# EasyEDA Pro project GD32_V1.1.epro, board PCB1
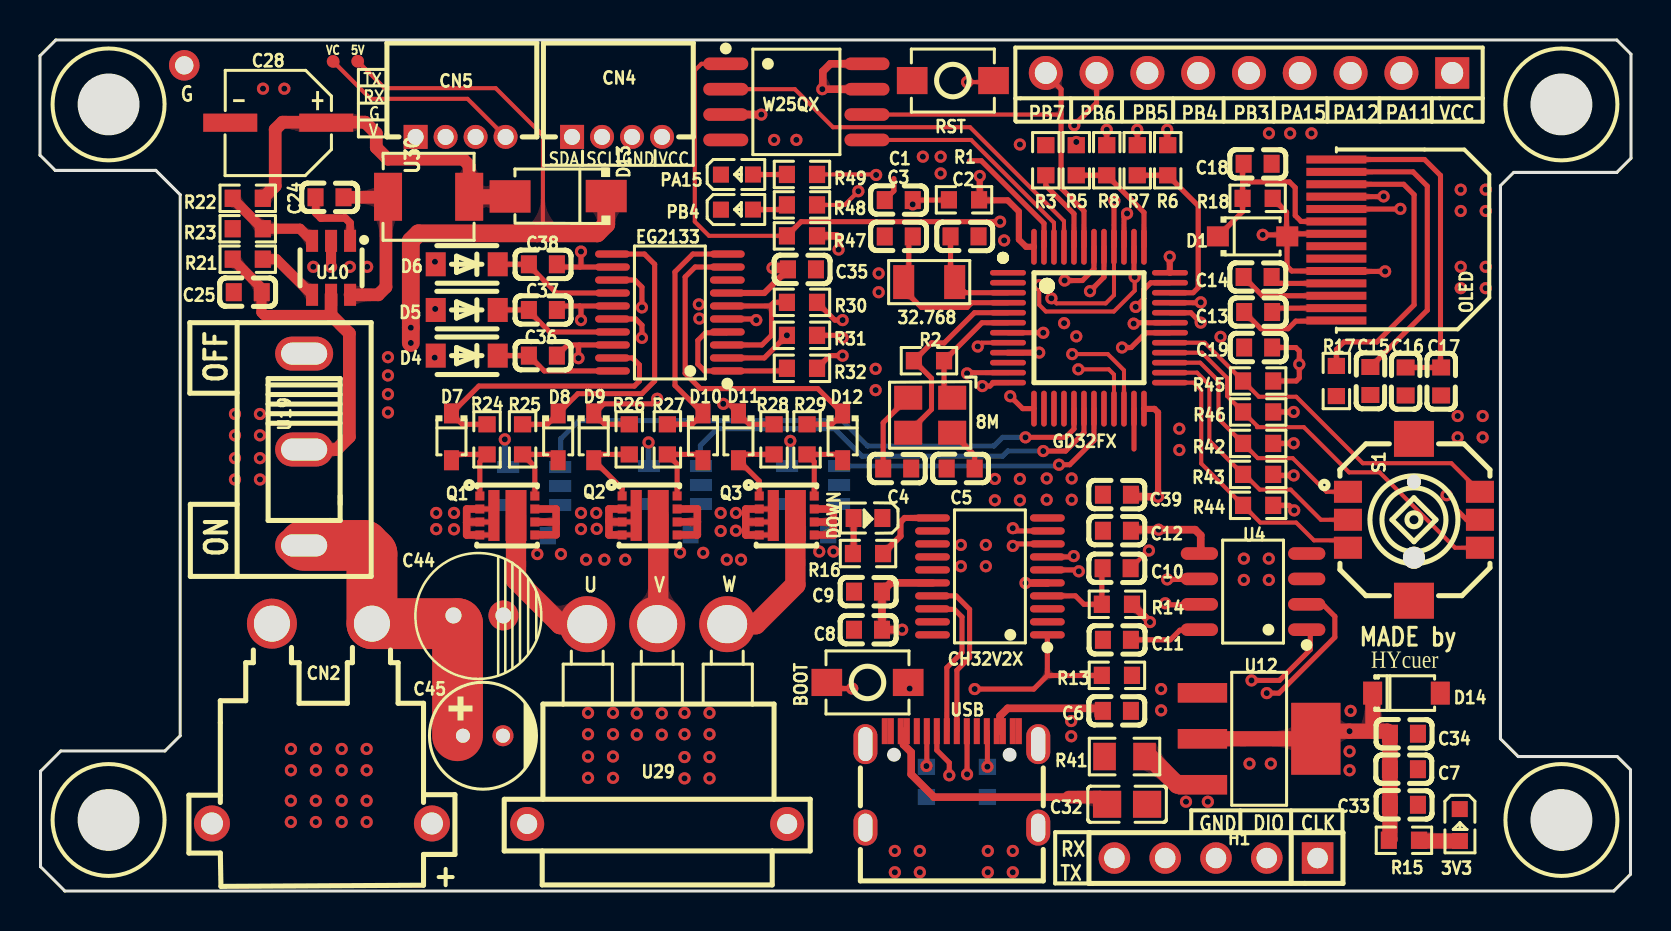
[diagram p4: board, top side]
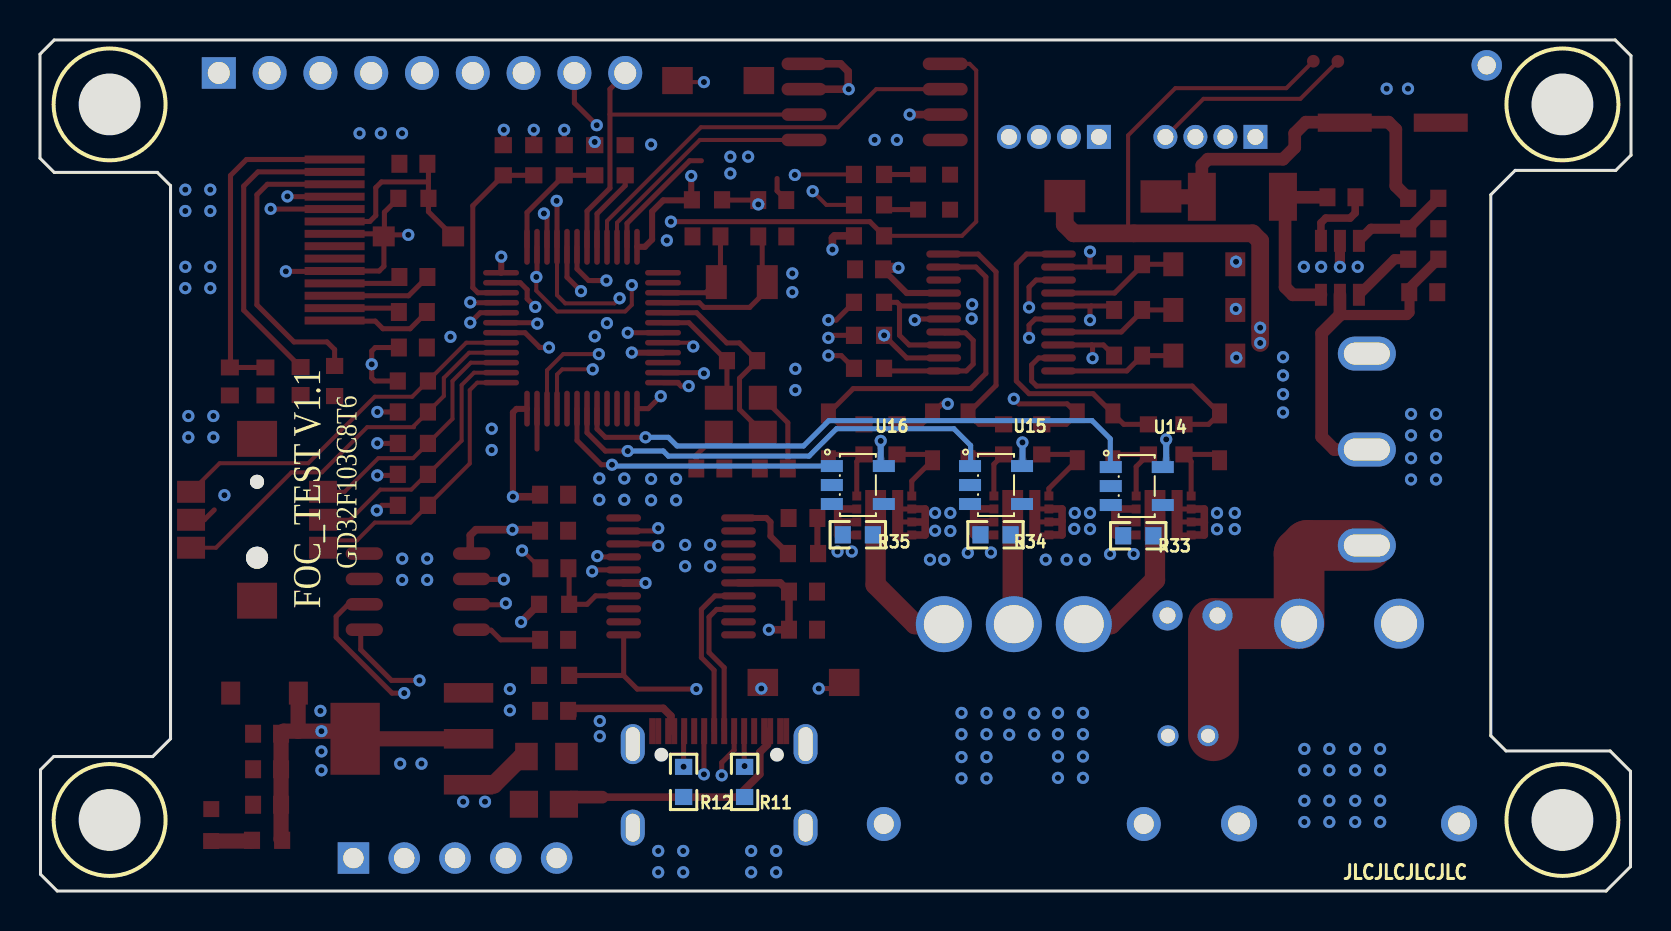
[diagram p5: board, bottom side, seen from below]

Outline 79.55 x 42.6 mm; copper layers: Top Layer, Inner1, Inner2, Bottom Layer. Coordinates in mm from the lower left corner of the outline.
Outline path: 0,41.8 0.79,42.6 78.84,42.6 79.55,41.88 79.55,36.68 78.84,35.97 73.69,35.97 73.03,35.31 73.03,7.62 73.91,6.73 78.87,6.73 79.53,6.07 79.53,0.84 78.69,0 1.24,0 0.03,1.22 0.03,5.99 1.04,7.01 6.25,7.01 7.01,7.77 7.01,34.85 5.79,36.07 0.76,36.07 0,36.83 0,41.8
Stack: Top Layer 0.035mm 外层铜厚1oz / Dielectric1 0.2104mm 7628 RC49% 8.6mil / Inner1 0.0152mm 内层铜厚 / Dielectric2 1.065mm 1.1mm H/HOZ 含铜 / Inner2 0.0152mm 内层铜厚 / Dielectric3 0.2104mm 7628 RC49% 8.6mil / Bottom Layer 0.035mm 外层铜厚1oz

## Design rules (mm)
template: 自定义配置
spacing copperThickness1oz (default): track to track 0.102, other pairs 0.152 to 0.3
spacing copperThickness2oz: track to track 0.203, other pairs 0.152 to 0.3
track width copperThickness1oz (default): min 0.127, default 0.254, max 2.54
track width copperThickness2oz: min 0.203, default 0.254, max 2.54
differential pair differentialPair (default): width min 0.127, default 0.254, max 2.54; gap min 0.152, default 0.152
via viaSize (default): diameter min 0.5, default 0.61, max 10; hole min 0.3, default 0.305, max 6.299

## Placement (name value [footprint] x y rotation side)
3V3  KT-0603R  [LED0603-RD]  70.99 3.3 270 top
8M  12MHz  [OSC-SMD_4P-L3.2-W2.5-BL]  44.51 23.82 180 top
32.768  32.768  [CRYSTAL-SMD_L3.2-W1.5-1]  44.46 30.48 0 top
BOOT  -  [SW-SMD_L4.0-W2.9-LS5.0]  41.38 10.44 180 top
C1  100nF  [C0603]  42.94 34.58 0 top
C2  10pf  [C0603]  46.23 32.77 180 top
C3  10pf  [C0603]  42.94 32.76 0 top
C4  20pf  [C0603]  42.86 21.15 180 top
C5  20pf  [C0603]  46.03 21.15 0 top
C6  10uF  [C0603]  53.85 9.02 0 top
C7  10uF  [C0603]  68.2 6.1 0 top
C8  100nF  [C0603]  41.4 13.08 180 top
C9  100nF  [C0603]  41.4 14.99 180 top
C10  1uF  [C0603]  53.83 16.16 180 top
C11  0.1u  [C0603]  53.85 12.57 180 top
C12  0.1u  [C0603]  53.85 18.03 0 top
C13  1uf  [C0603]  60.91 28.98 180 top
C14  1uf  [C0603]  60.88 30.73 180 top
C15  1uf  [C0603]  66.52 25.53 270 top
C16  0.1uf  [C0603]  68.28 25.5 270 top
C17  4.7uf  [C0603]  70.06 25.5 270 top
C18  0.1uf  [C0603]  60.88 36.4 180 top
C19  0.1uf  [C0603]  60.91 27.2 180 top
C24  100nF  [C0603]  14.48 34.72 180 top
C25  4.7uf  [C0603]  10.39 29.97 0 top
C28  22uf  [C_Ele_SMD_5x5.4mm]  11.91 38.46 180 top
C32  10uf  [C0805]  54.36 4.34 180 top
C33  1uf  [C0603]  68.2 4.32 180 top
C34  100nf  [C0603]  68.2 7.87 180 top
C35  100nF  [C0603]  38.1 31.12 180 top
C36  22uf  [C0603]  25.15 26.8 180 top
C37  22uf  [C0603]  25.15 29.08 180 top
C38  22uf  [C0603]  25.15 31.37 180 top
C39  0.1uf  [C0603]  53.85 19.84 0 top
C44  100uF 16V  [CAP-6*11]  23.17 13.79 270 top
C45  47uF,5*7,25V  [CAP-TH_BD5.2-P2.00-D0.5-FD]  22.15 7.77 0 top
CH32V2X  CH32V203F6P6  [TSSOP-20_L6.5-W4.4-P0.65-LS6.4-BL]  47.5 15.75 90 top
CN2  XT30PW-M  [CONN-TH_XT30PW-M]  14.1 8.38 0 top
CN4  HC-ZH1.5-4AW  [CONN-TH_4P-P1.50_HCTL_HC-ZH1.5-4AW]  28.85 37.74 180 top
CN5  HC-ZH1.5-4AW  [CONN-TH_4P-P1.50_HCTL_HC-ZH1.5-4AW]  21.03 37.74 180 top
D1  1N4148W  [SOD-123F_L2.7-W1.6-LS3.8-RD]  60.63 32.76 0 top
D4  FR107W  [SOD-123F_L2.8-W1.8-LS3.7-RD]  21.34 26.8 180 top
D5  FR107W  [SOD-123F_L2.8-W1.8-LS3.7-RD]  21.34 29.08 180 top
D6  FR107W  [SOD-123F_L2.8-W1.8-LS3.7-RD]  21.34 31.37 180 top
D7  IN4148WS  [SOD-323_L1.8-W1.3-LS2.5-RD]  20.57 22.73 270 top
D8  IN4148WS  [SOD-323_L1.8-W1.3-LS2.5-RD]  25.91 22.73 270 top
D9  IN4148WS  [SOD-323_L1.8-W1.3-LS2.5-RD]  27.69 22.74 270 top
D10  IN4148WS  [SOD-323_L1.8-W1.3-LS2.5-RD]  33.15 22.74 270 top
D11  IN4148WS  [SOD-323_L1.8-W1.3-LS2.5-RD]  34.93 22.73 270 top
D12  IN4148WS  [SOD-323_L1.8-W1.3-LS2.5-RD]  40.13 22.73 270 top
D13  SS34  [SMA_L4.3-W2.6-LS5.0-RD]  25.91 34.77 180 top
D14  PTVS36  [SOD-123_L2.8-W1.8-LS3.7-RD]  68.33 9.91 0 top
DOWN  19-217/BHC-ZL1M2RY/3T  [LED0603-FD_BLUE]  41.4 18.67 180 top
EG2133  EG2133  [TSSOP-20_L6.5-W4.4-P0.65-LS6.4-BL]  31.5 28.96 90 top
GD32FX  GD32F103C8T6  [TQFP-48_L7.0-W7.0-P0.50-LS9.0-BL]  52.45 28.19 270 top
H1  -  [HDR-TH_5P-P2.54-V-F]  58.8 1.65 180 top
H3  -  [HDR-TH_9P-P2.54-V-F-1]  60.45 40.95 180 top
NOREF  -  [Pad_e1221]  7.21 41.33 0 top
OLED  SSD1306-14Pin_JX  [SSD1306_SMD14pin_0.91inch]  65.2 32.26 0 top
PA15  -  [LED_0603]  34.9 35.87 0 top
PB4  -  [LED_0603]  34.9 34.11 0 top
Q1  DMT3009LDT-7  [V-DFN3030-8K_L3.0-W3.0-P0.65-BL]  23.37 18.8 270 top
Q2  DMT3009LDT-7  [V-DFN3030-8K_L3.0-W3.0-P0.65-BL]  30.48 18.8 270 top
Q3  DMT3009LDT-7  [V-DFN3030-8K_L3.0-W3.0-P0.65-BL]  37.34 18.8 270 top
R1  10K  [R0603]  46.2 34.6 0 top
R2  1M  [R0603]  44.45 26.54 0 top
R3  10K  [R0603]  50.29 36.58 270 top
R5  10K  [R0603]  51.82 36.58 90 top
R6  10K  [R0603]  56.39 36.58 270 top
R7  100  [R0603]  54.86 36.58 270 top
R8  100  [R0603]  53.34 36.58 270 top
R11  5.1kΩ  [R0603]  44.32 5.46 90 bottom
R12  5.1kΩ  [R0603]  47.37 5.46 270 bottom
R13  10kΩ  [R0603]  53.85 10.8 180 top
R14  10kΩ  [R0603]  53.85 14.35 0 top
R15  5.1kΩ  [R0603]  68.2 2.54 0 top
R16  5.1kΩ  [R0603]  41.4 16.89 180 top
R17  500k  [R0603]  64.82 25.53 90 top
R18  10K  [R0603]  60.88 34.67 180 top
R21  4.7k  [R0603]  10.39 31.62 0 top
R22  110k  [R0603]  10.39 34.67 180 top
R23  15k  [R0603]  10.39 33.15 180 top
R24  20  [R0603]  22.35 22.61 270 top
R25  20  [R0603]  24.13 22.61 90 top
R26  20  [R0603]  29.46 22.61 270 top
R27  20  [R0603]  31.37 22.61 90 top
R28  20  [R0603]  36.7 22.61 270 top
R29  20  [R0603]  38.35 22.61 90 top
R30  0  [R0603]  38.1 29.46 180 top
R31  0  [R0603]  38.1 27.81 180 top
R32  0  [R0603]  38.1 26.16 180 top
R33  0.01  [R0603]  24.64 17.78 180 bottom
R34  0.01  [R0603]  31.78 17.83 180 bottom
R35  0.01  [R0603]  38.66 17.83 180 bottom
R41  1.5A  [R0805]  54.23 6.73 0 top
R42  10K  [R0603]  60.91 22.4 180 top
R43  10K  [R0603]  60.91 20.85 180 top
R44  10K  [R0603]  60.91 19.3 180 top
R45  10K  [R0603]  60.91 25.53 0 top
R46  10K  [R0603]  60.91 23.98 180 top
R47  10K  [R0603]  38.1 32.79 180 top
R48  10K  [R0603]  38.1 34.34 180 top
R49  10K  [R0603]  38.1 35.87 180 top
RST  -  [SW-SMD_L4.0-W2.9-LS5.0]  45.64 40.56 0 top
S1  五向按键  [7*7]  68.71 18.59 0 top
TP4  -  [test-point-0.5mm]  14.66 41.52 0 top
TP5  -  [test-point-0.5mm]  15.88 41.53 0 top
TP6  M3铜柱  [M3定位孔]  76.07 3.56 0 top
TP7  M3铜柱  [M3定位孔]  76.07 39.37 0 top
TP8  M3铜柱  [M3定位孔]  3.43 3.56 0 top
TP9  M3铜柱  [M3定位孔]  3.43 39.37 0 top
U4  CH340N  [SOP-8_L4.9-W3.9-P1.27-LS6.0-BL]  60.66 14.99 90 top
U10  WD1305E20-6/TR  [SOT-23-6_L2.9-W1.6-P0.95-LS2.8-BR]  14.55 31.19 90 top
U12  TLV1117LV15DCYR  [SOT-223-4_L6.5-W3.5-P2.30-LS7.0-BR]  60.96 7.62 180 top
U14  INA180A3IDBVR  [SOT-23-5_L3.0-W1.7-P0.95-LS2.8-BR]  24.71 20.27 0 bottom
U15  INA180A3IDBVR  [SOT-23-5_L3.0-W1.7-P0.95-LS2.8-BR]  31.75 20.32 0 bottom
U16  INA180A3IDBVR  [SOT-23-5_L3.0-W1.7-P0.95-LS2.8-BR]  38.66 20.32 0 bottom
U19  SS12D10G8  [SW-TH_SHOU-HAN_SS12D10G4]  13.21 22.1 270 top
U29  -  [CONN-TH_MR30PW-M30-G-Y]  30.86 8.36 0 top
U30  KSMD0420AMT100  [IND-SMD_L4.4-W4.2-A]  19.43 34.75 0 top
USB  KH-TYPE-C-16P  [USB-C-SMD_KH-TYPE-C-16P]  45.59 5.59 0 top
W25QX  W25Q128JVSIQ  [SOIC-8_L5.3-W5.3-P1.27-LS8.0-BL]  37.82 39.5 270 top

## Footprints (pads in the part's own frame, mm; a bottom-side part is the same pattern mirrored in y, then rotated)
7*7
  rect 1.4x1.1 smd: 1(-3.307,1.389) 2(-3.307,-0.011) 3(-3.307,-1.411) 4(3.293,1.389) 5(3.293,-0.011) 6(3.293,-1.411)
  rect 2x1.8 smd: 7(-0.007,4.039) 8(-0.007,-4.061)
  round 0.7 hole 0.7: 9(-0.007,1.889)
  round 1.1 hole 1.1: 10(-0.007,-1.911)
C0603
  rect 0.8x0.9 smd: 1(-0.7,0) 2(0.7,0)
C0805
  rect 1.41x1.35 smd: 1(-1,0) 2(1,0)
C_Ele_SMD_5x5.4mm
  rect 2.7x0.91 smd: 1(-2.4,0) 2(2.4,0)
CAP-6*11
  round 1.5 hole 0.8: 1(0,-2.49) 2(0,0.01)
CAP-TH_BD5.2-P2.00-D0.5-FD
  round 1.052 hole 0.701: 1(-1,0) 2(1,0)
CONN-TH_4P-P1.50_HCTL_HC-ZH1.5-4AW
  rect 1.2x1.2 hole 0.8: 1(2.25,0)
  round 1.2 hole 0.8: 2(0.75,0) 3(-0.75,0) 4(-2.25,0)
CONN-TH_MR30PW-M30-G-Y
  round 2.8 hole 1.995x1.9: 1(-3.5,5) 2(0,5) 3(3.5,5)
  round 1.7 hole 1: 4(6.5,-5) 5(-6.5,-5)
CONN-TH_XT30PW-M
  round 2.5 hole 1.8: 1(-2.5,5) 2(2.5,5)
  round 1.8 hole 1.1: 3(5.5,-5) 4(-5.5,-5)
CRYSTAL-SMD_L3.2-W1.5-1
  rect 1.05x1.7 smd: 1(-1.275,0) 2(1.275,0)
HDR-TH_5P-P2.54-V-F
  rect 1.575x1.575 hole 1.02: 1(-5.08,0)
  round 1.575 hole 1.02: 2(-2.54,0) 3(0,0) 4(2.54,0) 5(5.08,0)
HDR-TH_9P-P2.54-V-F-1
  rect 1.7x1.575 hole 1.1: 1(-10.16,0)
  round 1.7 hole 1.1: 2(-7.62,0) 3(-5.08,0) 4(-2.54,0) 5(0,0) 6(2.54,0) 7(5.08,0) 8(7.62,0) 9(10.16,0)
IND-SMD_L4.4-W4.2-A
  rect 1.4x2.4 smd: 1(2.028,0) 2(-2.028,0)
LED0603-FD_BLUE
  rect 0.8x0.9 smd: 1(-0.72,0) 2(0.72,0)
LED0603-RD
  rect 0.8x0.8 smd: 1(-0.799,-0.004) 2(0.799,0.004)
LED_0603
  rect 0.8x0.8 smd: 1(-0.851,-0.01) 2(0.75,-0.005)
OSC-SMD_4P-L3.2-W2.5-BL
  rect 1.4x1.2 smd: 1(-1.1,-0.875) 2(1.1,-0.875) 3(1.1,0.875) 4(-1.1,0.875)
Pad_e1221
  round 1.524 hole 0.914: 49(0,0)
R0603
  rect 0.806x0.864 smd: 1(-0.753,0) 2(0.753,0)
R0805
  rect 1.133x1.377 smd: 1(-1,0) 2(1,0)
SMA_L4.3-W2.6-LS5.0-RD
  rect 2.046x1.62 smd: 1(-2.404,-0.009) 2(2.404,0.009)
SOD-123_L2.8-W1.8-LS3.7-RD
  rect 0.95x1.15 smd: 1(-1.692,0) 2(1.692,0)
SOD-123F_L2.7-W1.6-LS3.8-RD
  rect 1.1x1 smd: 1(-1.735,0) 2(1.735,0)
SOD-123F_L2.8-W1.8-LS3.7-RD
  rect 1x1.2 smd: 1(-1.55,0) 2(1.55,0)
SOD-323_L1.8-W1.3-LS2.5-RD
  rect 1x0.75 smd: 1(-1.173,0) 2(1.173,0)
SOIC-8_L5.3-W5.3-P1.27-LS8.0-BL
  oval 0.63x2.25 smd: 1(-1.905,-3.53) 2(-0.635,-3.53) 3(0.635,-3.53) 4(1.905,-3.53) 5(1.905,3.53) 6(0.635,3.53) 7(-0.635,3.53) 8(-1.905,3.53)
SOP-8_L4.9-W3.9-P1.27-LS6.0-BL
  oval 0.63x1.865 smd: 1(-1.905,-2.683) 2(-0.635,-2.683) 3(0.635,-2.683) 4(1.905,-2.683) 5(1.905,2.683) 6(0.635,2.683) 7(-0.635,2.683) 8(-1.905,2.683)
SOT-23-5_L3.0-W1.7-P0.95-LS2.8-BR
  rect 1.1x0.6 smd: 1(1.3,-0.95) 2(1.3,0) 3(1.3,0.95) 4(-1.3,0.95) 5(-1.3,-0.95)
SOT-23-6_L2.9-W1.6-P0.95-LS2.8-BR
  rect 1.1x0.6 smd: 1(1.35,-0.95) 2(1.35,0) 3(1.35,0.95) 4(-1.35,0.95) 5(-1.35,0) 6(-1.35,-0.95)
SOT-223-4_L6.5-W3.5-P2.30-LS7.0-BR
  rect 2.47x0.98 smd: 1(2.835,-2.3) 2(2.835,0) 3(2.835,2.3)
  rect 2.47x3.6 smd: 4(-2.835,0)
SSD1306_SMD14pin_0.91inch
  rect 3x0.4 smd: 1(-0.381,-3.705) 2(-0.381,-3.085) 3(-0.381,-2.465) 4(-0.381,-1.845) 5(-0.381,-1.225) 6(-0.381,-0.605) 7(-0.381,0.015) 8(-0.381,0.635) 9(-0.381,1.255) 10(-0.381,1.875) 11(-0.381,2.495) 12(-0.381,3.115) 13(-0.381,3.735) 14(-0.381,4.355)
SW-SMD_L4.0-W2.9-LS5.0
  rect 1.529x1.359 smd: 1(-2.034,0) 2(2.034,0)
SW-TH_SHOU-HAN_SS12D10G4
  oval 1.7x2.9 hole 1.1x2.3: 1(-4.8,0) 2(0,0) 3(4.8,0)
test-point-0.5mm
  round 0.635 smd: 1(0,0)
TQFP-48_L7.0-W7.0-P0.50-LS9.0-BL
  oval 0.28x1.8 smd: 1(-2.75,-4.05) 2(-2.25,-4.05) 3(-1.75,-4.05) 4(-1.25,-4.05) 5(-0.75,-4.05) 6(-0.25,-4.05) 7(0.25,-4.05) 8(0.75,-4.05) 9(1.25,-4.05) 10(1.75,-4.05) 11(2.25,-4.05) 12(2.75,-4.05) 25(2.75,4.05) 26(2.25,4.05) 27(1.75,4.05) 28(1.25,4.05) 29(0.75,4.05) 30(0.25,4.05) 31(-0.25,4.05) 32(-0.75,4.05) 33(-1.25,4.05) 34(-1.75,4.05) 35(-2.25,4.05) 36(-2.75,4.05)
  oval 1.8x0.28 smd: 13(4.05,-2.75) 14(4.05,-2.25) 15(4.05,-1.75) 16(4.05,-1.25) 17(4.05,-0.75) 18(4.05,-0.25) 19(4.05,0.25) 20(4.05,0.75) 21(4.05,1.25) 22(4.05,1.75) 23(4.05,2.25) 24(4.05,2.75) 37(-4.05,2.75) 38(-4.05,2.25) 39(-4.05,1.75) 40(-4.05,1.25) 41(-4.05,0.75) 42(-4.05,0.25) 43(-4.05,-0.25) 44(-4.05,-0.75) 45(-4.05,-1.25) 46(-4.05,-1.75) 47(-4.05,-2.25) 48(-4.05,-2.75)
TSSOP-20_L6.5-W4.4-P0.65-LS6.4-BL
  oval 0.364x1.742 smd: 1(-2.925,-2.871) 2(-2.275,-2.871) 3(-1.625,-2.871) 4(-0.975,-2.871) 5(-0.325,-2.871) 6(0.325,-2.871) 7(0.975,-2.871) 8(1.625,-2.871) 9(2.275,-2.871) 10(2.925,-2.871) 11(2.925,2.871) 12(2.275,2.871) 13(1.625,2.871) 14(0.975,2.871) 15(0.325,2.871) 16(-0.325,2.871) 17(-0.975,2.871) 18(-1.625,2.871) 19(-2.275,2.871) 20(-2.925,2.871)
USB-C-SMD_KH-TYPE-C-16P
  oval 1.2x2 hole 0.7x1.7: 1(-4.32,1.765) 2(4.32,1.765)
  oval 1.2x1.8 hole 0.7x1.4: 3(-4.32,-2.415) 4(4.32,-2.415)
  rect 0.3x1.3 smd: A1(-3.35,2.415) A4(-2.55,2.415) A5(-1.25,2.415) A6(-0.25,2.415) A7(0.25,2.415) A8(1.25,2.415) A9(2.55,2.415) A12(3.35,2.415) B1(3.05,2.415) B4(2.25,2.415) B5(1.75,2.415) B6(0.75,2.415) B7(-0.75,2.415) B8(-1.75,2.415) B9(-2.25,2.415) B12(-3.05,2.415)
V-DFN3030-8K_L3.0-W3.0-P0.65-BL
  rect 0.45x0.45 smd: 1(-0.975,-1.375) 2(-0.325,-1.375) 3(0.325,-1.375) 4(0.975,-1.375) 5(0.975,1.375) 6(0.325,1.375) 7(-0.325,1.375) 8(-0.975,1.375)
  rect 2.55x1.044 smd: 9(0,0.433)
  rect 2.55x0.556 smd: 10(0,-0.672)

## Nets
5V: C35.2 D4.2 D5.2 D6.2 EG2133.7 R41.2 U12.3
12V: C25.2 Q1.2 Q1.3 Q1.4 Q1.10 Q2.2 Q2.3 Q2.4 Q2.10 Q3.2 Q3.3 Q3.4 Q3.10 R21.1 U10.5 U19.2
+5V: C6.1 C32.2 D13.1 R41.1 TP5.1 USB.A4 USB.A9 USB.B4 USB.B9
GND: 3V3.1 C1.1 C2.1 C3.1 C4.1 C5.1 C6.2 C7.2 C8.2 C9.2 C10.1 C11.2 C12.1 C15.2 C16.2 C17.2 C18.1 C19.2 C25.1 C28.2 C32.1 C33.1 C34.1 C35.1 C39.1 C44.2 C45.2 CH32V2X.15 CN2.1 CN4.3 CN5.3 D14.2 DOWN.1 EG2133.8 GD32FX.8 GD32FX.23 GD32FX.35 GD32FX.47 H1.3 NOREF.49 OLED.7 PA15.1 PB4.1 R3.1 R5.2 R11.1 R12.2 R13.1 R17.1 R23.2 R33.2 R34.2 R35.2 RST.1 S1.5 U4.3 U10.2 U12.1 U14.2 U14.4 U15.2 U15.4 U16.2 U16.4 USB.1 USB.2 USB.3 USB.4 USB.A1 USB.A12 USB.B1 USB.B12 W25QX.4
VCC: BOOT.2 C7.1 C8.1 C9.1 C12.2 C19.1 C33.2 C34.2 C39.2 CH32V2X.5 CH32V2X.16 CN4.4 CN5.4 D1.2 D14.1 GD32FX.9 GD32FX.24 GD32FX.36 GD32FX.48 H3.1 OLED.5 OLED.8 R1.2 R6.1 R14.2 R15.1 R18.1 R42.1 R43.1 R44.1 R45.2 R46.1 R47.1 TP4.1 U4.5 U12.2 U12.4 U14.5 U15.5 U16.5 W25QX.3 W25QX.7 W25QX.8
ADC1: GD32FX.17 U14.1
ADC2: GD32FX.18 U15.1
ADC3: GD32FX.19 U16.1
AS5600_SCL: CN4.2 GD32FX.41 H3.7
AS5600_SDA: CN4.1 GD32FX.39 H3.5
CDC_RXD: CH32V2X.9 H1.5
CDC_TXD: CH32V2X.8 H1.4
DM: CH32V2X.17 USB.A7
DP: CH32V2X.18 USB.A6
FLASH_CLK: GD32FX.43 H3.9 W25QX.6
FLASH_CS: GD32FX.42 H3.8 R47.2 W25QX.1
FLASH_MISO: GD32FX.45 W25QX.2
FLASH_MOSI: GD32FX.46 W25QX.5
HO1: D7.1 EG2133.19 R24.1
HO2: D9.1 EG2133.16 R26.1
HO3: D11.1 EG2133.13 R28.1
KEY1: GD32FX.27 R42.2 S1.1
KEY2: GD32FX.26 R43.2 S1.2
KEY3: GD32FX.25 R44.2 S1.3
KEY4: GD32FX.28 R46.2 S1.6
KEY5: GD32FX.29 R45.1 S1.4
LED_SWD: CH32V2X.11 R16.1
LO1: D8.1 EG2133.11 R25.2
LO2: D10.1 EG2133.10 R27.2
LO3: D12.1 EG2133.9 R29.2
NRST: C1.2 GD32FX.7 R1.1 RST.2
OUT_U: C36.1 EG2133.18 Q1.9 U29.1
OUT_V: C37.1 EG2133.15 Q2.9 U29.2
OUT_W: C38.1 EG2133.12 Q3.9 U29.3
PA11: GD32FX.32 H3.2 OLED.10
PA12: GD32FX.33 H3.3 OLED.11
PA15: GD32FX.38 H3.4 R49.1
PB4: GD32FX.40 H3.6 R48.1
PWM1: EG2133.1 EG2133.4 GD32FX.11 R32.1 R32.2
PWM2: EG2133.2 EG2133.5 GD32FX.12 R31.1 R31.2
PWM3: EG2133.3 EG2133.6 GD32FX.13 R30.1 R30.2
RST: C10.2 CH32V2X.4 R14.1
RX0: GD32FX.31 U4.6
S2_U: Q1.5 Q1.6 Q1.7 R33.1 U14.3
S2_V: Q2.5 Q2.6 Q2.7 R34.1 U15.3
S2_W: Q3.5 Q3.6 Q3.7 R35.1 U16.3
SCL: GD32FX.14
SDA: GD32FX.15
SWD_CLK: CH32V2X.7 H1.1 R8.1
SWD_DIO: CH32V2X.6 H1.2 R7.1
TX0: GD32FX.30 U4.7
UD+: U4.1 USB.B6
UD-: U4.2 USB.B7
USART_RX: CN5.2 GD32FX.22
USART_TX: CN5.1 GD32FX.21
$1N734: 32.768.2 C2.2 GD32FX.3
$1N739: 32.768.1 C3.2 GD32FX.4
$1N1091: 8M.4 C5.2
$1N1101: 8M.3 GD32FX.5 R2.1
$1N1108: 8M.2 C4.2
$1N1138: 8M.1 GD32FX.6 R2.2
$1N1208: GD32FX.44 R3.2
$1N1297: GD32FX.34 R6.2 R7.2
$1N1307: GD32FX.37 R5.1 R8.2
$1N2575: C15.1 OLED.13
$1N2583: C16.1 C17.1 OLED.14
$1N11891: C18.2 D1.1 OLED.9 R18.2
$1N15112: C13.2 OLED.1
$1N15114: C13.1 OLED.2
$1N15116: C14.2 OLED.3
$1N15118: C14.1 OLED.4
$1N15120: OLED.12 R17.2
$1N15441: PB4.2 R48.2
$1N15467: PA15.2 R49.2
$2N749: R21.2 U10.4
$2N836: C24.1 U10.6 U30.2
$2N843: C24.2 U10.1
$2N1195: R22.2 R23.1 U10.3
$2N1887: C28.1 D13.2 R22.1 U30.1
$4N669: R11.2 USB.A5
$4N708: R12.1 USB.B5
$4N1404: BOOT.1 CH32V2X.1 R13.2
$4N2473: DOWN.2 R16.2
$4N2476: 3V3.2 R15.2
$4N8043: C11.1 U4.8
$5N596: C36.2 D4.1 EG2133.20
$5N697: C37.2 D5.1 EG2133.17
$5N794: C38.2 D6.1 EG2133.14
$5N1150: D7.2 Q1.1 R24.2
$5N1261: D8.2 Q1.8 R25.1
$5N1488: D9.2 Q2.1 R26.2
$5N1506: D10.2 Q2.8 R27.1
$5N1733: D11.2 Q3.1 R28.2
$5N1751: D12.2 Q3.8 R29.1
$5N6748: C44.1 C45.1 CN2.2 U19.3

Pads without a net: CH32V2X 2 3 10 12 13 14 19 20; CN2 3 4; GD32FX 1 2 10 16 20; OLED 6; S1 7 8 9 10; U4 4; U19 1; U29 4 5; USB A8 B8

## Via types
v1: diameter 0.61, hole 0.305, Top Layer to Bottom Layer, 236 vias

## Routing (per net, layer and track width the routed paths; a pad name or vN(x,y) marks a point on that pad's centre or on a via; arc(x,y) is an arc through that point)
5V: length 87.9
  Top Layer w0.305: C35.2 36.22,29.93 34.37,29.93
  Top Layer w0.508: C35.2 37.32,31.19 v1(36.63,31.19)
  Top Layer w0.889: R41.2 55.46,6.73 56.87,5.32 U12.3
  Inner1 w0.508: v1(19.76,29.13) 25.96,29.13 28.02,31.19 v1(36.63,31.19)
  Inner1 w0.635: v1(19.75,31.5) 19.76,31.48 v1(19.76,29.13) 19.71,29.08 19.74,29.06 v1(19.74,26.7) 19.74,22.58 21.39,20.93 36.91,20.93 38.18,19.66 38.18,7.21 40.46,4.93 54.56,4.93 55.02,4.47 v1(57.3,4.47) v1(58.39,4.47)
12V: length 60.1
  Top Layer w0.254: 35.95,19.12 36.65,19.12 36.65,18.8 ; 22.64,18.47 22.7,18.52 ; 22.64,18.47 Q1.3 ; 22.64,18.47 22.64,17.82 Q1.4 ; 22.64,18.47 22.7,18.47 22.7,18.52 ; 22.7,18.52 22.7,19.12 Q1.2 ; 29.76,18.47 29.76,17.82 Q2.4 ; 29.76,18.47 29.81,18.47 Q2.10 29.81,19.12 Q2.2 ; 29.76,18.47 Q2.3 ; 35.95,17.82 36.6,17.82 ; 36.6,18.47 35.95,18.47
  Top Layer w0.381: 35.29,18.52 35.29,19.12 35.95,19.12 ; 35.29,18.52 35.34,18.47 35.95,18.47 ; 35.29,18.52 35.29,17.82 35.95,17.82 ; 28.45,18.52 28.45,19.12 Q2.2 ; 28.45,18.52 28.45,17.82 Q2.4 ; 28.45,18.52 28.49,18.47 Q2.3 ; 21.34,18.45 21.34,17.82 Q1.4 ; 21.34,18.45 21.36,18.47 Q1.3 ; 21.34,18.45 21.34,19.12 Q1.2
  Top Layer w0.508: 14.55,28.83 11.2,28.83 11.07,28.96 11.07,29.96 C25.2 11.09,30.17 R21.1
  Top Layer w0.635: U19.2 14.83,22.1 15.47,22.73 15.47,27.91 14.55,28.83 U10.5
  Inner1 w2.54: U19.2 15.11,22.1 18.54,18.67 36.07,18.67
  vias: v1(19.81,18.92) v1(19.81,18.11) v1(20.7,18.92) v1(20.7,18.11) v1(27.05,18.92) v1(27.05,18.12) v1(27.81,18.92) v1(27.84,18.13) v1(34.04,18.92) v1(34.04,18.02) v1(34.8,18.92) v1(34.8,18.03)
+5V: length 103.2
  Top Layer w0.203: 24.86,32.92 25.15,33.21 25.15,37.82 22.78,40.18 17.23,40.18 TP5.1
  Top Layer w0.381: 48.01,8 48.01,8.76 48.39,9.14 52.91,9.14 52.91,8.78 ; 43.18,8 43.18,7.33 43.56,6.94 43.56,5.84 44.7,4.7 51.44,4.7
  Top Layer w0.635: C32.2 53,4.7 51.44,4.7
  Top Layer w0.889: v1(18.54,27.43) v1(18.54,28.19) 18.54,32.54 18.92,32.92 27.86,32.92 28.31,33.37 D13.1
  Inner2 w0.889: v1(18.54,28.19) v1(18.54,27.43) 18.54,12.65 19.99,11.2 50.13,11.2 51.56,9.77 v1(51.56,8.51) v1(51.56,7.75)
GND: length 17.5
  Top Layer w0.203: v1(55.45,17.05) 55.42,17.05 C10.1 ; GD32FX.8 47.08,27.44 v1(46.89,27.25)
  Top Layer w0.254: 70.84,19.08 71.33,18.58 S1.5 ; GD32FX.23 54.7,22.12 ; 46.48,36.55 47.07,36.55 50.2,33.42 GD32FX.47 ; 42.7,35.66 42.7,35.04 C1.1 ; v1(54.79,29.24) 55.19,29.64 55.19,30.1 55.54,30.44 GD32FX.35
  Top Layer w0.508: U10.2 v1(14.55,31.24)
  vias: v1(9.75,23.88) v1(9.75,22.81) v1(9.75,21.67) v1(9.75,20.6) v1(11,23.88) v1(11,22.81) v1(11,21.67) v1(11,20.6) v1(11.15,40.16) v1(12.22,40.16) v1(12.55,7.11) v1(12.55,6.05) v1(12.54,4.52) v1(12.54,3.45) v1(13.67,31.24) v1(13.8,7.11) v1(13.8,6.05) v1(13.79,4.52) v1(13.79,3.45) v1(15.08,7.11) v1(15.08,6.05) v1(15.08,4.52) v1(15.08,3.45) v1(15.49,31.24) v1(16.36,31.24) v1(16.33,7.11) v1(16.33,6.05) v1(16.33,4.52) v1(16.33,3.45) v1(17.4,26.72) v1(17.4,25.81) v1(17.4,24.87) v1(17.4,23.95) v1(27.31,16.59) v1(27.4,8.92) v1(27.4,7.85) v1(27.4,6.73) v1(27.4,5.66) v1(28.22,16.59) v1(28.65,8.92) v1(28.65,7.85) v1(28.65,6.73) v1(28.65,5.66) v1(29.26,16.59) v1(29.84,8.89) v1(29.84,7.82) v1(31.09,8.89) v1(31.09,7.82) v1(32.23,8.92) v1(32.23,7.85) v1(32.23,6.71) v1(32.23,5.64) v1(32.94,29.36) v1(32.97,28.65) v1(33.48,8.92) v1(33.48,7.85) v1(33.48,6.71) v1(33.48,5.64) v1(34.34,16.59) v1(35.05,16.59) v1(36.71,37.59) v1(37.82,37.59) v1(41.78,26.14) v1(41.78,25.07) v1(41.94,30.91) v1(41.94,29.97) v1(42.74,2.01) v1(42.74,0.94) v1(43.99,2.01) v1(43.99,0.94) v1(44.15,36.75) v1(45.03,36.75) v1(45.03,35.92) v1(46.05,17.32) v1(46.05,16.26) v1(47.29,17.32) v1(47.3,16.26) v1(47.39,2.01) v1(47.39,0.94) v1(47.75,20.62) v1(47.75,19.56) v1(48.21,32.56) v1(48.64,2.01) v1(48.64,0.94) v1(49,37.36) v1(49,20.62) v1(49,19.56) v1(50.34,20.65) v1(50.34,19.58) v1(51.21,28.42) v1(51.59,20.65) v1(51.59,19.58) v1(51.82,37.49) v1(51.82,27.76) v1(56.06,10.11) v1(56.06,9.04) v1(56.97,23.14) v1(56.97,22.07) v1(59.03,27.74) v1(60.19,16.64) v1(60.19,15.57) v1(60.48,6.38) v1(61.45,37.93) v1(61.44,16.64) v1(61.44,15.57) v1(61.54,6.38) v1(62.51,37.92) v1(63.58,37.92) v1(70.33,19.81) v1(70.89,23.77) v1(70.89,22.71) v1(71.04,35.1) v1(71.04,34.04) v1(71.04,31.24) v1(71.04,30.18) v1(72.13,23.77) v1(72.14,22.71) v1(72.29,35.1) v1(72.29,34.04) v1(72.29,31.24) v1(72.29,30.18)
VCC: length 90
  Top Layer w0.203: TP4.1 16.53,39.65 21.38,39.65 CN5.4
  Top Layer w0.254: R45.2 62.81,25.53 62.97,25.68 v1(62.97,26.37) 62.97,27.03 62.79,27.2 C19.1 ; v1(62.69,22.41) 62.68,22.4 R42.1 ; R44.1 62.46,19.3 v1(62.71,19.05) ; v1(67.26,31.01) 64.84,31.01 64.82,31.03 62.59,31.03 62.36,31.27 62.36,32.76 62.27,32.84 v1(61.14,32.84) ; R18.1 62.33,33.98 62.33,32.8 D1.2 62.36,32.89 64.82,32.89 ; 39.34,10.44 39.65,10.13 v1(40.61,10.13) ; v1(62.69,23.98) R46.1 ; v1(62.69,20.8) 61.71,20.8 R43.1
  Top Layer w0.305: v1(55.91,19.74) 55.91,23.95 55.73,24.13 55.22,24.13 GD32FX.24 ; v1(56.49,31.75) 56.49,30.96 GD32FX.36 ; GD32FX.48 49.31,32.24 48.95,32.61 48.95,34.01 48.39,34.57 46.98,34.57 R1.2 46.99,34.63 v1(46.99,35.79) ; v1(56.36,38.1) 56.36,37.36 R6.1 ; GD32FX.9 49.96,26.94 v1(49.96,26.95)
  Top Layer w0.381: W25QX.3 v1(36.07,38.86) ; v1(43.11,13.08) 42.1,13.08 C8.1 C9.1 42.54,15.42 CH32V2X.16 ; 54.77,20.08 54.77,19.74 v1(55.91,19.74) ; W25QX.7 v1(39.12,40.13) 39.14,40.16 39.14,41.02 39.52,41.4 W25QX.8 ; CH32V2X.5 50.36,15.42 v1(49.28,15.42) ; C12.2 54.6,18.09 v1(55.93,18.09) 57.76,18.09 58.04,17.81 58.04,17.13 58.15,17.02 ; v1(55.5,13.46) 54.61,14.35 R14.2 ; v1(39.93,32.11) 39.93,32.69 39.83,32.79 R47.1
  Top Layer w0.762: 66.65,8 66.65,9.89 D14.1 ; 66.65,8 v1(65.48,8) 63.75,8 ; 66.65,8 67.37,8 C34.2 C7.1 C33.2 67.5,2.59 R15.1 ; U12.2 U12.4
  Bottom Layer w0.305: U14.5 23.24,21.39 v1(23.24,22.61) ; U16.5 37.52,21.43 v1(37.52,22.53) ; 30.45,21.27 30.43,21.29 v1(30.43,22.45)
  vias: v1(65.53,9.02) v1(65.48,6.99) v1(65.48,6.04)
ADC1: length 29.4
  Top Layer w0.254: v1(49.28,22.71) 51.28,22.71 51.7,23.13 GD32FX.17
  Bottom Layer w0.254: U14.1 26.03,21.24 26.03,22.63 26.95,23.55 40.11,23.55 41.38,22.28 47.7,22.28 48.13,22.71 v1(49.28,22.71)
ADC2: length 22.8
  Top Layer w0.254: GD32FX.18 52.2,22.94 51.28,22.02 v1(50.16,22.02)
  Bottom Layer w0.254: U15.1 33.02,21.3 33.02,22.3 33.86,23.14 39.73,23.14 41.1,21.77 48.13,21.77 48.39,22.02 v1(50.16,22.02)
ADC3: length 14.9
  Top Layer w0.254: v1(50.95,21.34) 51.49,21.34 52.7,22.55 GD32FX.19
  Bottom Layer w0.254: v1(50.95,21.34) 50.89,21.27 U16.1
AS5600_SCL: length 43.4
  Top Layer w0.254: v1(52.5,30.02) 53.2,30.72 GD32FX.41
  Inner2 w0.254: 54.1,39.62 54.1,37.47 52.5,35.87 v1(52.5,30.02) ; 54.1,39.62 55.37,40.89 ; 54.1,39.62 49.63,39.62 47.73,41.53 31.06,41.53 28.1,38.57 CN4.2
AS5600_SDA: length 47.4
  Top Layer w0.254: GD32FX.39 54.2,33.75 v1(54.36,33.91)
  Inner2 w0.254: 60.45,40.89 60.45,40.01 v1(54.36,33.91) ; H3.5 59.26,42.14 31,42.14 CN4.1
CDC_RXD: length 37.1
  Top Layer w0.254: v1(48.64,18.16) 48.78,18.02 CH32V2X.9
  Inner2 w0.254: H1.5 55.93,3.86 60.76,3.86 62.61,5.72 62.61,10.67 61.85,11.43 51.69,11.43 48.01,15.11 48.01,17.65 48.51,18.16 v1(48.64,18.16)
CDC_TXD: length 34.2
  Top Layer w0.254: v1(48.64,17.27) 48.74,17.37 CH32V2X.8
  Inner2 w0.254: H1.4 58.04,3.43 61.21,3.43 63.25,5.46 63.25,10.8 61.98,12.07 51.69,12.07 48.64,15.11 v1(48.64,17.27)
DM: length 8.5
  Top Layer w0.254: USB.A7 45.85,8.01 45.85,11.05 46.48,11.68 46.48,14.1 45.81,14.77 CH32V2X.17
DP: length 7.7
  Top Layer w0.254: CH32V2X.18 44.65,14.1 45.72,14.1 46.1,13.72 46.1,11.94 45.34,11.18 USB.A6
FLASH_CLK: length 19.1
  Top Layer w0.203: W25QX.6 51.04,38.86 51.05,38.87
  Top Layer w0.254: GD32FX.43 52.2,34.03 51.05,35.18 51.05,40.13 50.29,40.89
FLASH_CS: length 42.9
  Top Layer w0.203: R47.2 33.45,32.79 32.74,33.5 32.74,41.07 33.07,41.4 W25QX.1
  Top Layer w0.254: 51.97,30.56 v1(51.23,30.56) 52.12,30.56 52.7,31.14 GD32FX.42 ; v1(51.71,38.33) 52.83,39.45 H3.8 ; v1(48.01,33.5) 38.06,33.5 R47.2
  Inner2 w0.254: v1(48.01,33.5) 51.23,33.5 ; 51.23,33.5 51.23,37.85 v1(51.71,38.33) ; 51.23,33.5 v1(51.23,30.56)
FLASH_MISO: length 20.9
  Top Layer w0.203: W25QX.2 37.74,40.13 39.65,38.23 46.51,38.23 51.2,33.53 GD32FX.45
FLASH_MOSI: length 12.3
  Top Layer w0.203: W25QX.5 46.56,37.59 50.7,33.45 GD32FX.46
HO1: length 14.4
  Top Layer w0.254: EG2133.19 29.62,26.68 29.97,26.33 29.97,25.53 29.72,25.27 21.94,25.27 D7.1 21.12,23.36 R24.1
HO2: length 11.4
  Top Layer w0.254: v1(30.1,27.69) 30.1,28.32 29.79,28.63 EG2133.16 ; R26.1 28.24,23.36 D9.1 27.72,23.91 28.19,24.38 30.61,24.38 v1(30.86,24.64)
  Inner2 w0.254: v1(30.1,27.69) 31.24,26.54 31.24,25.02 v1(30.86,24.64)
HO3: length 12.1
  Top Layer w0.254: EG2133.13 29.74,30.58 30.1,30.23 v1(30.1,29.21) ; R28.1 35.47,23.36 D11.1 34.45,24.38 v1(34.16,24.38)
  Inner2 w0.254: v1(30.1,29.21) 34.16,25.15 v1(34.16,24.38)
KEY1: length 12.7
  Top Layer w0.203: GD32FX.27 58.01,26.44 58.93,25.53 58.93,23.63 R42.2 60.89,21.67 62.64,21.67 64.32,19.98 S1.1
KEY2: length 13.6
  Top Layer w0.203: S1.2 64.04,18.58 62.53,20.09 60.99,20.09 60.22,20.85 R43.2 58.47,22.54 58.47,25.32 57.85,25.94 GD32FX.26
KEY3: length 14.5
  Top Layer w0.203: GD32FX.25 57.69,25.44 58.06,25.07 58.06,21.4 R44.2 61.02,18.44 62.81,18.44 63.7,17.55 65.03,17.55 S1.3
KEY4: length 20.1
  Top Layer w0.203: S1.6 70.75,17.18 66.98,20.96 65.46,20.96 63.19,23.22 60.86,23.22 60.86,23.28 R46.2 59.36,24.77 59.36,25.68 58.09,26.94 GD32FX.28
KEY5: length 18.6
  Top Layer w0.203: S1.4 70.57,21.41 66.14,21.41 62.81,24.74 60.94,24.74 R45.1 58.24,27.44 GD32FX.29
LED_SWD: length 3.6
  Top Layer w0.305: CH32V2X.11 43.24,18.67 43.03,18.47 43.03,17.76 R16.1
LO1: length 15.7
  Top Layer w0.254: R25.2 25.36,23.36 D8.1 26.89,24.89 30.1,24.89 30.73,25.53 30.73,31.37 30.22,31.88 EG2133.11
LO2: length 12.7
  Top Layer w0.254: EG2133.10 32.64,31.88 31.75,30.99 31.75,25.31 D10.1 32.6,23.36 R27.2
LO3: length 17.8
  Top Layer w0.254: R29.2 39.59,23.36 D12.1 38.89,25.15 33.02,25.15 32.26,25.91 32.26,30.73 32.75,31.23 EG2133.9
NRST: length 29.8
  Top Layer w0.203: v1(46.35,40.49) 47.6,40.49 RST.2
  Top Layer w0.254: C1.2 45.44,34.58 R1.1 ; GD32FX.7 50.16,27.94 v1(50.16,27.94)
  Inner2 w0.203: v1(50.16,27.94) 50.06,27.94 v1(43.64,34.37) 40.36,34.37 39.88,34.85 39.88,39.88 40.49,40.49 v1(46.35,40.49)
OUT_U: length 26.4
  Top Layer w0.254: 26.97,27.33 26.38,27.33 C36.1 ; 26.97,27.33 EG2133.18 ; 26.97,27.33 26.92,27.29 v1(26.92,26.67)
  Top Layer w1.016: U29.1 26.01,13.36 23.8,15.57 Q1.9
  Inner2 w0.254: 26.98,14.44 26.08,14.44 24.28,16.23 24.28,24.03 v1(26.92,26.67)
OUT_V: length 24.6
  Top Layer w0.254: 26.99,29.28 27.05,29.22 v1(27.05,28.58) ; 26.99,29.28 EG2133.15 ; 26.99,29.28 26.04,29.28 C37.1
  Top Layer w1.016: U29.2 30.91,13.41 Q2.9
  Inner2 w0.254: 30.48,14.44 30.48,18.54 27.69,21.34 27.69,27.94 v1(27.05,28.58)
OUT_W: length 33.5
  Top Layer w0.254: C38.1 25.98,31.23 27,31.23 ; v1(27.05,32) 27.05,31.28 27,31.23 ; 27,31.23 EG2133.12
  Top Layer w1.016: Q3.9 37.77,15.33 35.8,13.36 U29.3
  Inner2 w0.203: U29.3 34.36,14.06 33.78,14.64 33.78,17.35 28.3,22.83 28.3,31.62 27.91,32 v1(27.05,32)
PA11: length 24.5
  Top Layer w0.254: OLED.10 68.01,34.13 v1(68.02,34.14) ; GD32FX.32 57.54,28.94 v1(58.04,28.45)
  Inner2 w0.254: v1(58.04,28.45) 63.04,28.45 68.02,33.43 v1(68.02,34.14) 68.02,40.84 68.07,40.89
PA12: length 22.4
  Top Layer w0.254: GD32FX.33 57.91,29.44 ; v1(67.18,34.77) 67.17,34.75 64.82,34.75
  Inner2 w0.254: v1(58.04,29.46) 62.69,29.46 67.18,33.96 v1(67.18,34.77) 67.18,39.24 65.53,40.89
PA15: length 35.5
  Top Layer w0.203: R49.1 41.78,35.87 v1(41.81,35.84) ; v1(54.74,30.73) 54.74,30.05 53.7,29.01 50.29,29.01 49.96,29.34 v1(49.96,30.33)
  Top Layer w0.254: v1(54.74,30.73) 54.7,30.77 GD32FX.38
  Inner2 w0.203: v1(49.96,30.33) 49.53,30.33 44.02,35.84 v1(41.81,35.84)
  Inner2 w0.254: 62.99,40.89 62.99,40.54 54.74,32.28 v1(54.74,30.73)
PB4: length 30.5
  Top Layer w0.203: v1(40.92,35.03) 40.23,34.34 R48.1 ; GD32FX.40 53.7,29.83 53.29,29.41 50.83,29.41 v1(50.57,29.67)
  Top Layer w0.254: GD32FX.40 53.7,34.52 v1(53.72,34.54)
  Inner2 w0.203: v1(40.92,35.03) 40.97,35.08 ; 40.97,35.08 43.94,35.08 49.35,29.67 v1(50.57,29.67) ; 40.97,35.08 40.94,35.1
  Inner2 w0.254: v1(53.72,34.54) 57.91,38.74 57.91,40.89
PWM1: length 17.7
  Top Layer w0.254: R32.2 37.22,26.03 EG2133.1 33.23,26.03 32.89,26.37 32.89,27.56 33.27,27.94 34.33,27.94 EG2133.4 ; v1(40.13,26.8) 39.49,26.8 R32.1 ; GD32FX.11 46.39,25.94 v1(46.35,25.91)
  Inner2 w0.254: v1(46.35,25.91) 45.47,26.8 v1(40.13,26.8)
PWM2: length 17.9
  Top Layer w0.254: v1(40.13,27.69) 40,27.81 R31.1 ; v1(47.12,25.27) 47.5,25.27 47.67,25.44 GD32FX.12 ; EG2133.2 36.21,26.68 v1(37.35,27.81) ; EG2133.5 35.76,28.63 v1(35.81,28.58)
  Inner1 w0.254: v1(35.81,28.58) 36.58,28.58 v1(37.35,27.81)
  Inner2 w0.254: v1(40.13,27.69) 45.57,27.69 47.12,26.14 v1(47.12,25.27)
PWM3: length 21.1
  Top Layer w0.254: v1(40.13,28.58) 39.74,28.58 R30.1 ; 36.58,29.28 EG2133.6 ; 36.58,29.28 36.58,27.81 36.09,27.33 EG2133.3 ; 36.58,29.28 36.58,29.34 36.7,29.46 R30.2 ; v1(48.51,24.77) 49.13,24.14 GD32FX.13
  Inner2 w0.254: v1(48.51,24.77) 48.51,26.67 46.61,28.58 v1(40.13,28.58)
RST: length 4.7
  Top Layer w0.254: CH32V2X.4 51.78,14.77 52.2,14.35 R14.1 53.09,16.12 C10.2
RX0: length 17.6
  Top Layer w0.254: v1(54.69,28.4) 54.73,28.44 GD32FX.31 ; 58.15,15.75 58,15.6 v1(56.36,15.6)
  Inner2 w0.254: v1(56.36,15.6) 55.68,15.6 54.69,16.59 v1(54.69,28.4)
S2_U: length 4.5
  Top Layer w0.381: Q1.5 24.75,17.83 25.81,17.83 25.81,18.43 ; 25.81,18.43 25.81,19.12 Q1.7 ; 25.81,18.43 25.76,18.47 Q1.6
  vias: v1(24.87,16.87) v1(26.05,16.87)
S2_V: length 4.3
  Top Layer w0.381: Q2.7 32.87,19.12 32.87,18.48 ; Q2.5 32.86,17.82 32.87,17.83 32.87,18.48 ; 32.87,18.48 32.86,18.47 Q2.6
  vias: v1(32,16.94) v1(33.16,16.93)
S2_W: length 4.2
  Top Layer w0.381: Q3.5 39.66,17.82 39.67,17.81 39.67,18.45 ; Q3.7 39.67,19.12 39.67,18.45 ; 39.67,18.45 39.64,18.47 Q3.6
  vias: v1(38.96,16.99) v1(39.68,16.99)
SWD_CLK: length 57.5
  Top Layer w0.254: v1(51.69,16.76) 51.65,16.72 50.37,16.72 ; R8.1 v1(53.34,38.1)
  Inner2 w0.254: v1(53.34,38.1) 51.89,36.65 51.89,29.46 52.53,28.83 52.53,17.6 v1(51.69,16.76) 51.61,16.76 51.36,16.51 51.36,15.44 54.36,12.45 62.48,12.45 63.88,11.05 63.88,5.08 61.65,2.85 60.38,2.85 59.94,2.41 59.94,1.02 60.41,0.55 62.78,0.55 H1.1
SWD_DIO: length 50.4
  Top Layer w0.254: CH32V2X.6 51.87,16.07 v1(51.94,16) ; R7.1 v1(54.86,38.1)
  Inner2 w0.254: v1(54.86,38.1) 54.86,36.7 53.09,34.93 53.09,16 ; 53.09,16 v1(51.94,16) ; 53.09,16 53.79,16 56.07,13.72 61.85,13.72 64.39,11.18 64.39,4.7 H1.2
TX0: length 18.5
  Top Layer w0.254: v1(54.1,27.2) 54.56,27.2 55.3,27.94 GD32FX.30 ; 58.3,14.33 56.34,14.33 v1(56.26,14.4)
  Inner2 w0.254: v1(56.26,14.4) 56.16,14.4 54.1,16.46 v1(54.1,27.2)
UD+: length 23.4
  Top Layer w0.254: v1(46.35,5.84) 46.35,7.99 USB.B6 ; v1(60.58,10.54) 61.98,10.54 63.52,12.08 63.52,13.21
  Inner2 w0.254: v1(60.58,10.54) 55.45,5.41 46.79,5.41 v1(46.35,5.84)
UD-: length 28.1
  Top Layer w0.254: 63.52,14.48 63.72,14.28 64.21,14.28 64.74,13.74 64.74,12.7 61.95,9.91 v1(61.34,9.91) ; v1(45.47,5.79) 45.47,6.43 44.84,7.05 USB.B7
  Inner2 w0.254: v1(61.34,9.91) 60.5,9.91 55.63,5.03 45.8,5.03 45.47,5.36 v1(45.47,5.79)
USART_RX: length 46.8
  Top Layer w0.203: v1(51.61,26.87) 53.39,26.87 54.2,26.06 GD32FX.22
  Inner2 w0.203: v1(51.61,26.87) 48.77,24.03 36.98,24.03 35.15,25.86 35.15,29.29 30.48,33.96 21.13,33.96 20.28,34.81 CN5.2
USART_TX: length 47.3
  Top Layer w0.203: GD32FX.21 53.7,25.85 53.44,26.11 v1(51.92,26.11)
  Inner2 w0.203: v1(51.92,26.11) 49.45,23.65 36.68,23.65 34.8,25.53 34.8,28.96 30.4,33.35 20.35,33.35 18.75,34.95 18.75,37.71 CN5.1
$1N734: length 5.3
  Top Layer w0.254: 45.53,32.77 45.53,30.69 32.768.2 46.27,29.94 GD32FX.3
$1N739: length 8.5
  Top Layer w0.254: GD32FX.4 46.59,29.44 46.35,29.21 44.07,29.21 43.19,30.09 32.768.1 43.44,30.73 43.44,32.57 C3.2
$1N1091: length 2.3
  Top Layer w0.254: C5.2 46.74,21.82 8M.4
$1N1101: length 10.1
  Top Layer w0.254: GD32FX.5 46.72,28.94 45.21,27.43 44.59,27.43 R2.1 44.58,25.66 44.58,24.11 8M.3
$1N1108: length 4.1
  Top Layer w0.254: 8M.2 42.16,23.44 42.16,21.15
$1N1138: length 6
  Top Layer w0.254: GD32FX.6 47.1,28.44 R2.2 45.2,25.1 8M.1
$1N1208: length 4.2
  Top Layer w0.254: GD32FX.44 51.7,33.9 50.29,35.31 R3.2
$1N1297: length 9.3
  Top Layer w0.254: R7.2 R6.2 57.91,34.3 57.91,30.2 57.66,29.94 GD32FX.34
$1N1307: length 5.9
  Top Layer w0.254: R5.1 R8.2 55.2,33.96 GD32FX.37
$1N2575: length 15.1
  Top Layer w0.254: C15.1 69.37,29.07 69.37,35.28 68.66,35.99 OLED.13
$1N2583: length 16.9
  Top Layer w0.254: C16.1 70,26.2 70.03,26.24 ; 70.03,26.24 C17.1 ; 70.03,26.24 70.03,35.81 69.23,36.61 OLED.14
$1N11891: length 10.5
  Top Layer w0.254: 60.13,35.49 60.13,36.35 60.18,36.4 ; 60.13,35.49 R18.2 60.13,34 D1.1 ; 60.13,35.49 62.48,35.49 62.76,35.2 62.76,33.81 63.06,33.51 OLED.9
$1N15112: length 5.1
  Top Layer w0.254: OLED.1 64.79,28.52 62.79,28.52 62.41,28.14 61.05,28.14 C13.2
$1N15114: length 3.3
  Top Layer w0.254: C13.1 61.8,29.17 64.82,29.17
$1N15116: length 5
  Top Layer w0.254: OLED.3 61.12,29.79 60.18,30.73
$1N15118: length 3.4
  Top Layer w0.254: OLED.4 61.9,30.41 C14.1
$1N15120: length 15.2
  Top Layer w0.254: R17.2 64.82,27.1 65.2,27.48 66.85,27.48 68.71,29.34 68.71,34.85 68.18,35.37 OLED.12
$1N15441: length 1.8
  Top Layer w0.254: R48.2 37.11,34.11 PB4.2
$1N15467: length 1.7
  Top Layer w0.254: R49.2 37.34,35.86 PA15.2
$2N749: length 3.2
  Top Layer w0.508: U10.4 11.82,31.62 R21.2
$2N836: length 8.7
  Top Layer w0.635: 17.38,34.72 17.3,34.64 17.3,30.23 16.91,29.84 U10.6 ; 17.38,34.72 C24.1 ; 17.38,34.72 U30.2
$2N843: length 3.6
  Top Layer w0.381: U10.1 15.5,33.44 15.27,33.68 14.05,33.68 13.79,33.93 13.79,34.71 C24.2
$2N1195: length 4.9
  Top Layer w0.508: R22.2 9.64,34.65 R23.1 13,33.15 U10.3
$2N1887: length 18.5
  Top Layer w0.635: R22.1 11.76,35.29 11.76,38.12 12.12,38.48 16.26,38.48 16.81,37.92 16.81,37.21 17.4,36.63 21.16,36.63 21.46,36.33 U30.1
  Top Layer w0.762: U30.1 23.49,34.75 23.5,34.76
$4N669: length 1.8
  Top Layer w0.254: USB.A5 44.34,6.28 v1(44.32,6.26)
$4N708: length 1.8
  Top Layer w0.254: USB.B5 47.37,7.98 v1(47.37,6.22)
$4N1404: length 11.9
  Top Layer w0.254: R13.2 53.09,10.79 50.37,10.79 ; 50.37,10.79 49.69,10.11 v1(46.74,10.11) ; 50.37,10.79 CH32V2X.1
  Inner2 w0.254: v1(46.74,10.11) 46.71,10.13 v1(43.49,10.13)
$4N2473: length 1.8
  Top Layer w0.305: DOWN.2 40.68,16.92 R16.2
$4N2476: length 2.1
  Top Layer w0.762: R15.2 68.99,2.5 3V3.2
$4N8043: length 3.9
  Top Layer w0.254: 58.15,13.21 58,13.06 57,13.06 56.52,12.57 C11.1
$5N596: length 6.1
  Top Layer w0.254: EG2133.20 25.21,26.03 C36.2 22.89,26.8
$5N697: length 6.2
  Top Layer w0.254: 22.89,29.08 C37.2 24.45,29.02 25.49,27.98 EG2133.17
$5N794: length 6.4
  Top Layer w0.254: 22.89,31.37 C38.2 24.45,31.31 25.82,29.93 28.62,29.93
$5N1150: length 4.1
  Top Layer w0.254: D7.2 20.87,21.85 R24.2 21.99,21.49 Q1.1
$5N1261: length 4.2
  Top Layer w0.254: Q1.8 24.74,21.24 R25.1 25.62,21.85 D8.2
$5N1488: length 4.4
  Top Layer w0.254: R26.2 27.69,21.85 D9.2 29.11,20.14 Q2.1
$5N1506: length 4.2
  Top Layer w0.254: D10.2 32.86,21.85 R27.1 31.86,21.36 Q2.8
$5N1733: length 4.1
  Top Layer w0.254: Q3.1 35.96,20.52 D11.2 35.22,21.85 R28.2
$5N1751: length 4.1
  Top Layer w0.254: Q3.8 38.71,21.49 R29.1 39.84,21.85 D12.2
$5N6748: length 17
  Top Layer w2.54: 20.88,7.77 20.88,13.38 CN2.2 16.6,16.88 16.18,17.3 U19.3

## Copper pours and planes (outline as drawn; the poured copper is in the pictures)
5V on Top Layer: 56.87,5.32 59.03,5.32 59.03,4.17 56.87,4.17
12V on Top Layer: 19.3,19.3 21.46,19.3 21.46,17.63 19.3,17.63
12V on Top Layer: 33.57,19.3 35.47,19.3 35.47,17.65 33.57,17.65
12V on Top Layer: 26.61,19.3 28.64,19.3 28.64,17.65 26.61,17.65
+5V on Top Layer: 51.18,9.35 53.2,9.35 53.2,4.49 51.18,4.49
GND on Top Layer: 6.4,43.74 73.81,43.74 73.81,-2.44 6.4,-2.44
GND on Top Layer: 48.64,8.64 50.89,8.64 50.89,7.35 48.64,7.35
GND on Bottom Layer: 6.4,43.74 73.81,43.74 73.81,-2.44 6.4,-2.44
GND on Inner1: 6.4,43.74 73.81,43.74 73.81,-2.44 6.4,-2.44
GND on Inner2: 6.4,43.74 73.81,43.74 73.81,-2.44 6.4,-2.44
VCC on Top Layer: 63.88,9.42 66.04,9.42 66.04,5.84 63.89,5.84 63.88,5.83
VCC on Inner1: 38.74,21.87 39.83,20.78 39.83,10.41 41.5,8.74 55.09,8.74 56.08,7.75 56.08,6.1 56.87,5.32 65.65,5.32 66.17,4.8 66.17,2.19 66.81,1.54 68.29,1.54 68.62,1.88 68.62,36.82 69.7,37.9 71.83,37.9 72.62,38.68 72.62,41.42 72.14,41.9 69.84,41.9 69.42,41.48 69.42,40.08 68.63,39.29 43.89,39.29 42.6,40.58 23.44,40.58 22.45,39.6 22.45,36.78 22.94,36.3 36.7,36.3 37.76,35.24 37.76,25.62 36.65,24.51 23.09,24.51 22.65,24.08 22.65,22.44 23.22,21.87
S2_U on Top Layer: 24.64,18.04 24.64,16.51 26.49,16.51 26.49,16.51 26.49,18.04 26.49,18.04
S2_U on Bottom Layer: 24.49,19.36 26.57,19.36 26.57,16.49 24.47,16.49 24.47,19.34
S2_V on Top Layer: 31.61,18.06 31.61,16.53 33.46,16.53 33.47,16.53 33.47,18.06 33.46,18.06
S2_V on Bottom Layer: 31.6,19.47 33.68,19.47 33.68,16.54 31.58,16.54 31.58,19.45
S2_W on Top Layer: 38.49,18.02 38.49,16.56 40.09,16.56 40.09,18.02
S2_W on Bottom Layer: 38.52,19.44 40.61,19.44 40.61,16.55 38.5,16.55 38.5,19.42

Small or netless copper shapes (teardrops, artwork), in the pictures only: 437 on Top Layer, 6 on Bottom Layer, 2 on Inner1, 69 on Inner2

## Text on the board
Bottom Silkscreen Layer: JLCJLCJLCJLC | GD32F103C8T6 | FOC_TEST V1.1
Top Silkscreen Layer: VC | 5V | TX | RX | G | V | SDA | SCL | GND | VCC | PB7 | PB6 | PB5 | PB4 | PB3 | DIO | PA15 | CLK | PA12 | PA11 | U | W | MADE by | + | OFF | ON | HYcuer
